# Altium schematic sheet P3_CCD_CAM_BOARD_CAMERA.SchDoc
size A4
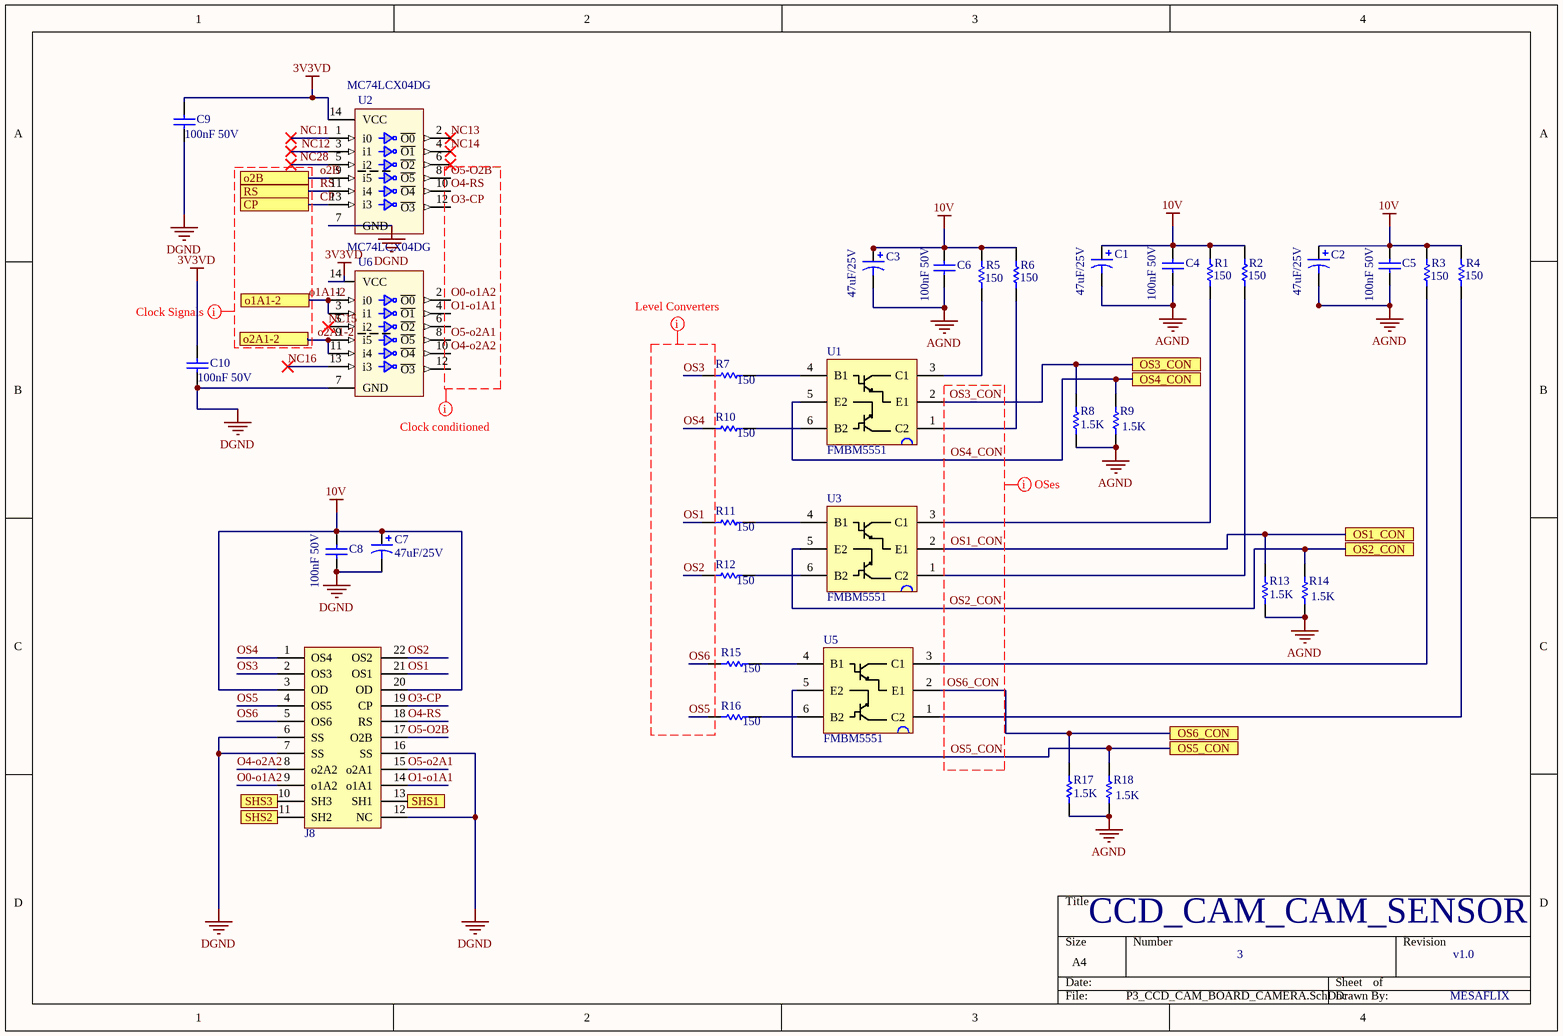
[diagram p0: P3_CCD_CAM_BOARD_CAMERA.SchDoc]

## Parts
C1  value 47uF/25V  [1206 (3216)]  (hidden comment: Cap)
C2  value 47uF/25V  [1206 (3216)]  (hidden comment: Cap)
C3  value 47uF/25V  [1206 (3216)]  (hidden comment: Cap)
C4  100nF 50V  [CAP0603]
C5  100nF 50V  [CAP0603]
C6  100nF 50V  [CAP0603]
C7  value 47uF/25V  [1206 (3216)]  (hidden comment: Cap)
C8  100nF 50V  [CAP0603]
C9  100nF 50V  [CAP0603]
C10  100nF 50V  [CAP0603]
J8  CONN  [CCD_SENSOR_PIN]  (value not drawn)
R1  value 150  [0402 (1005)]  (hidden comment: Res Semi)
R2  value 150  [0402 (1005)]  (hidden comment: Res Semi)
R3  value 150  [0402 (1005)]  (hidden comment: Res Semi)
R4  value 150  [0402 (1005)]  (hidden comment: Res Semi)
R5  value 150  [0402 (1005)]  (hidden comment: Res Semi)
R6  value 150  [0402 (1005)]  (hidden comment: Res Semi)
R7  value 150  [0402 (1005)]  (hidden comment: Res Semi)
R8  value 1.5K  [0402 (1005)]  (hidden comment: Res Semi)
R9  value 1.5K  [0402 (1005)]  (hidden comment: Res Semi)
R10  value 150  [0402 (1005)]  (hidden comment: Res Semi)
R11  value 150  [0402 (1005)]  (hidden comment: Res Semi)
R12  value 150  [0402 (1005)]  (hidden comment: Res Semi)
R13  value 1.5K  [0402 (1005)]  (hidden comment: Res Semi)
R14  value 1.5K  [0402 (1005)]  (hidden comment: Res Semi)
R15  value 150  [0402 (1005)]  (hidden comment: Res Semi)
R16  value 150  [0402 (1005)]  (hidden comment: Res Semi)
R17  value 1.5K  [0402 (1005)]  (hidden comment: Res Semi)
R18  value 1.5K  [0402 (1005)]  (hidden comment: Res Semi)
U1  FMBM5551  [SOT95P285X140-6N]
U2  MC74LCX04DG  [SOIC127P600X175-14N]
U3  FMBM5551  [SOT95P285X140-6N]
U5  FMBM5551  [SOT95P285X140-6N]
U6  MC74LCX04DG  [SOIC127P600X175-14N]

## Ports
CP, o1A1-2, o2A1-2, o2B, OS1_CON, OS2_CON, OS3_CON, OS4_CON, OS5_CON, OS6_CON, RS, SHS1, SHS2, SHS3

## Nets
3V3VD: C9.2 C10.2 U2.14(VCC) U6.14(VCC)
10V: C1.1 C2.1 C3.1 C4.2 C5.2 C6.2 C7.1 C8.2 J8.3(OD) J8.20(OD) R1.1 R2.1 R3.1 R4.1 R5.1 R6.1
AGND: C1.2 C2.2 C3.2 C4.1 C5.1 C6.1 R8.2 R9.1 R13.2 R14.1 R17.2 R18.1
DGND: C7.2 C8.1 C9.1 C10.1 J8.6(SS) J8.7(SS) J8.12(NC) J8.16(SS) U2.7(GND) U6.7(GND)
CP: U2.13(i3) ; port CP
NC11: U2.1(i0)
NC12: U2.3(i1)
NC13: U2.2(~{O0})
NC14: U2.4(~{O1})
NC15: U6.5(i2)
NC16: U6.13(i3)
NC28: U2.5(i2)
O0-o1A2: J8.9(o1A2) U6.2(~{O0})
O1-o1A1: J8.14(o1A1) U6.4(~{O1})
o1A1-2: U6.1(i0) U6.3(i1) ; port o1A1-2
o2A1-2: U6.9(i5) U6.11(i4) ; port o2A1-2
o2B: U2.9(i5) ; port o2B
O3-CP: J8.19(CP) U2.12(~{O3})
O4-o2A2: J8.8(o2A2) U6.10(~{O4})
O4-RS: J8.18(RS) U2.10(~{O4})
O5-o2A1: J8.15(o2A1) U6.8(~{O5})
O5-O2B: J8.17(O2B) U2.8(~{O5})
OS1: J8.21(OS1) R11.1
OS1_CON: R13.1 U3.2(E1) ; port OS1_CON
OS2: J8.22(OS2) R12.1
OS2_CON: R14.2 U3.5(E2) ; port OS2_CON
OS3: J8.2(OS3) R7.1
OS3_CON: R8.1 U1.2(E1) ; port OS3_CON
OS4: J8.1(OS4) R10.1
OS4_CON: R9.2 U1.5(E2) ; port OS4_CON
OS5: J8.4(OS5) R16.1
OS5_CON: R18.2 U5.5(E2) ; port OS5_CON
OS6: J8.5(OS6) R15.1
OS6_CON: R17.1 U5.2(E1) ; port OS6_CON
RS: U2.11(i4) ; port RS
SHS1: J8.13(SH1) ; port SHS1
SHS2: J8.11(SH2) ; port SHS2
SHS3: J8.10(SH3) ; port SHS3
NetR1_2: R1.2 U3.3(C1)
NetR2_2: R2.2 U3.1(C2)
NetR3_2: R3.2 U5.3(C1)
NetR4_2: R4.2 U5.1(C2)
NetR5_2: R5.2 U1.3(C1)
NetR6_2: R6.2 U1.1(C2)
NetR7_2: R7.2 U1.4(B1)
NetR10_2: R10.2 U1.6(B2)
NetR11_2: R11.2 U3.4(B1)
NetR12_2: R12.2 U3.6(B2)
NetR15_2: R15.2 U5.4(B1)
NetR16_2: R16.2 U5.6(B2)

Not connected (* = marked no-connect by the designer): U2 6(~{O2})*; U6 6(~{O2}) 12(~{O3})

## Layout directives
rule Matched Net Lengths [Tolerance = 0.05mm]; net class level_converters: OS1, OS2, OS3, OS4, OS5, OS6
rule Matched Net Lengths [Tolerance = 0.05mm]; net class clock_conditioned: O0-o1A2, O1-o1A1, O3-CP, O4-o2A2, O4-RS, O5-o2A1, O5-O2B
rule Matched Net Lengths [Tolerance = 0.05mm]; net class oses: OS1_CON, OS2_CON, OS3_CON, OS4_CON, OS5_CON, OS6_CON
rule Matched Net Lengths [Tolerance = 0.05mm]; net class clock_signals: o1A1-2

## Notes on the sheet
- CCD_CAM_CAM_SENSOR
- 3
- v1.0
- MESAFLIX

## Library data of the parts
C1-C3 C7 = Cap Chip Pol: GRM31CR61E476ME44L / Chip capacitor can be polarized or not, depending on the chip type.  Verify Capacitance and package size before placing.; Mfr Part #: GRM31CR61E476ME44L
C4-C6 C8-C10 = CAP0603_100nF: CAP CER 0.1UF 50V X7R 0603; P/N: C0603C104K5RACTU; Order Code: DIGI : 399-5089-1-ND; Value: 100nF 50V
J8 = CCD_SENSOR_PIN: 11x2 Connector
R1-R7 R10-R12 R15 R16 = Res Semi: Semiconductor Resistor; Mfr Part #: RC0402FR-07150RL
R8 R9 R13 R14 R17 R18 = Res Semi: Semiconductor Resistor; Mfr Part #: RC0402FR-071K5L
U2 U6 = MC74LCX04DG: Inverter IC 6 Channel 14-SOIC; Value: *